# Vivado block design base_with_comblock_desing, xc7z020clg400-1, Vivado 2019.1
# (continued, part 2 of 3)
current_bd_instance /video/hdmi_out

create_bd_cell -type ip -vlnv xilinx.com:ip:axis_register_slice:1.1 axis_register_slice_0
create_bd_cell -type ip -vlnv xilinx.com:hls:color_convert:1.0 color_convert
create_bd_cell -type hier frontend
create_bd_cell -type ip -vlnv xilinx.com:hls:pixel_unpack:1.0 pixel_unpack

# ---- hierarchy /video/hdmi_out/frontend ----
current_bd_instance /video/hdmi_out/frontend
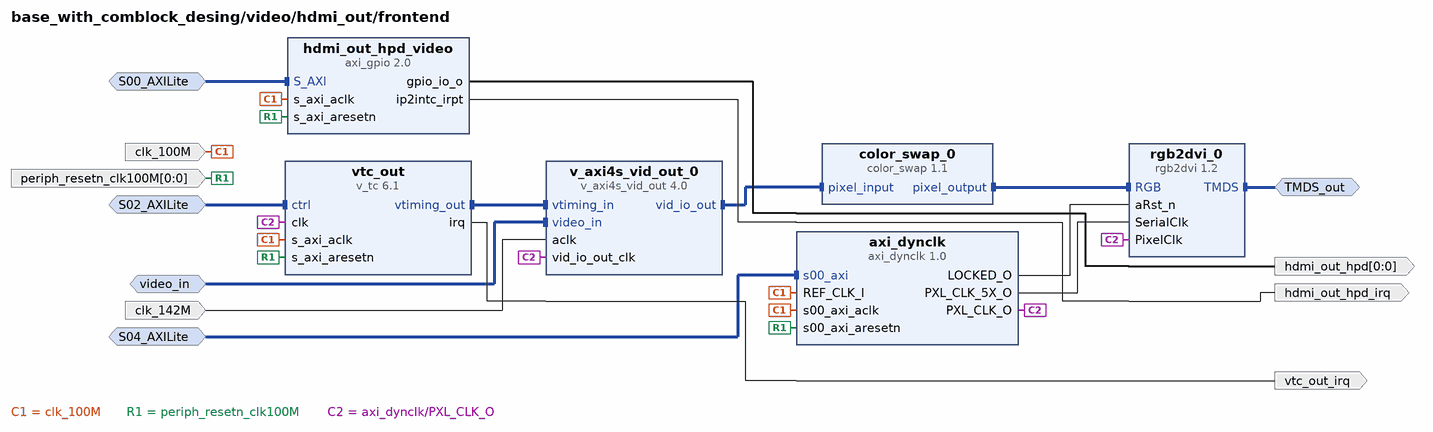
[diagram p17: block diagram inside /video/hdmi_out/frontend]
create_bd_intf_pin -mode Slave -vlnv xilinx.com:interface:aximm_rtl:1.0 S00_AXILite
create_bd_intf_pin -mode Slave -vlnv xilinx.com:interface:aximm_rtl:1.0 S02_AXILite
create_bd_intf_pin -mode Slave -vlnv xilinx.com:interface:aximm_rtl:1.0 S04_AXILite
create_bd_intf_pin -mode Master -vlnv digilentinc.com:interface:tmds_rtl:1.0 TMDS_out
create_bd_intf_pin -mode Slave -vlnv xilinx.com:interface:axis_rtl:1.0 video_in
create_bd_pin -dir I -type clk clk_100M
create_bd_pin -dir I -type clk clk_142M
create_bd_pin -dir O -from 0 -to 0 hdmi_out_hpd
create_bd_pin -dir O -type intr hdmi_out_hpd_irq
create_bd_pin -dir I -from 0 -to 0 -type rst periph_resetn_clk100M
create_bd_pin -dir O -type intr vtc_out_irq

create_bd_cell -type ip -vlnv digilentinc.com:ip:axi_dynclk:1.0 axi_dynclk
create_bd_cell -type ip -vlnv xilinx.com:user:color_swap:1.1 color_swap_0
create_bd_cell -type ip -vlnv xilinx.com:ip:axi_gpio:2.0 hdmi_out_hpd_video
set_property -dict {CONFIG.C_ALL_OUTPUTS 1 CONFIG.C_GPIO_WIDTH 1 CONFIG.C_INTERRUPT_PRESENT 1} [get_bd_cells hdmi_out_hpd_video]
create_bd_cell -type ip -vlnv digilentinc.com:ip:rgb2dvi:1.2 rgb2dvi_0
set_property -dict {CONFIG.kClkRange 2 CONFIG.kGenerateSerialClk false CONFIG.kRstActiveHigh false} [get_bd_cells rgb2dvi_0]
create_bd_cell -type ip -vlnv xilinx.com:ip:v_axi4s_vid_out:4.0 v_axi4s_vid_out_0
set_property -dict [list \
  CONFIG.C_ADDR_WIDTH 11 \
  CONFIG.C_HAS_ASYNC_CLK 1 \
  CONFIG.C_HYSTERESIS_LEVEL 1024 \
  CONFIG.C_VTG_MASTER_SLAVE 1 \
] [get_bd_cells v_axi4s_vid_out_0]
create_bd_cell -type ip -vlnv xilinx.com:ip:v_tc:6.1 vtc_out
set_property -dict {CONFIG.enable_detection false} [get_bd_cells vtc_out]

# ---- connections ----

current_bd_instance /iop_arduino
connect_bd_intf_net [get_bd_intf_pins lmb/BRAM_PORTB] [get_bd_intf_pins mb_bram_ctrl/BRAM_PORTA]
connect_bd_intf_net [get_bd_intf_pins ck_io] [get_bd_intf_pins gpio_subsystem/ck_gpio]
connect_bd_intf_net [get_bd_intf_pins S_AXI] [get_bd_intf_pins mb_bram_ctrl/S_AXI]
connect_bd_intf_net [get_bd_intf_pins arduino_gpio] [get_bd_intf_pins io_switch_0/io]
connect_bd_intf_net [get_bd_intf_pins Vaux0] [get_bd_intf_pins xadc/Vaux0]
connect_bd_intf_net [get_bd_intf_pins arduino_direct_iic] [get_bd_intf_pins iic_subsystem/arduino_direct_iic]
connect_bd_intf_net [get_bd_intf_pins Vaux13] [get_bd_intf_pins xadc/Vaux13]
connect_bd_intf_net [get_bd_intf_pins Vaux15] [get_bd_intf_pins xadc/Vaux15]
connect_bd_intf_net [get_bd_intf_pins Vaux1] [get_bd_intf_pins xadc/Vaux1]
connect_bd_intf_net [get_bd_intf_pins Vaux9] [get_bd_intf_pins xadc/Vaux9]
connect_bd_intf_net [get_bd_intf_pins Vaux12] [get_bd_intf_pins xadc/Vaux12]
connect_bd_intf_net [get_bd_intf_pins intc/interrupt] [get_bd_intf_pins mb/INTERRUPT]
connect_bd_intf_net [get_bd_intf_pins Vaux6] [get_bd_intf_pins xadc/Vaux6]
connect_bd_intf_net [get_bd_intf_pins arduino_direct_spi] [get_bd_intf_pins spi_subsystem/arduino_direct_spi]
connect_bd_intf_net [get_bd_intf_pins Vp_Vn] [get_bd_intf_pins xadc/Vp_Vn]
connect_bd_intf_net [get_bd_intf_pins Vaux5] [get_bd_intf_pins xadc/Vaux5]
connect_bd_intf_net [get_bd_intf_pins gpio_subsystem/arduino_gpio] [get_bd_intf_pins io_switch_0/gpio]
connect_bd_intf_net [get_bd_intf_pins Vaux8] [get_bd_intf_pins xadc/Vaux8]
connect_bd_intf_net [get_bd_intf_pins intr/S_AXI] [get_bd_intf_pins microblaze_0_axi_periph/M04_AXI]
connect_bd_intf_net [get_bd_intf_pins M_AXI] [get_bd_intf_pins microblaze_0_axi_periph/M07_AXI]
connect_bd_intf_net [get_bd_intf_pins io_switch_0/S_AXI] [get_bd_intf_pins microblaze_0_axi_periph/M02_AXI]
connect_bd_intf_net [get_bd_intf_pins gpio_subsystem/S01_AXILite] [get_bd_intf_pins microblaze_0_axi_periph/M03_AXI]
connect_bd_intf_net [get_bd_intf_pins iic_subsystem/S_AXI1] [get_bd_intf_pins microblaze_0_axi_periph/M01_AXI]
connect_bd_intf_net [get_bd_intf_pins gpio_subsystem/S00_AXILite] [get_bd_intf_pins microblaze_0_axi_periph/M05_AXI]
connect_bd_intf_net [get_bd_intf_pins microblaze_0_axi_periph/M00_AXI] [get_bd_intf_pins spi_subsystem/S00_AXILite]
connect_bd_intf_net [get_bd_intf_pins microblaze_0_axi_periph/M06_AXI] [get_bd_intf_pins spi_subsystem/S01_AXILite]
connect_bd_intf_net [get_bd_intf_pins mb/M_AXI_DP] [get_bd_intf_pins microblaze_0_axi_periph/S00_AXI]
connect_bd_intf_net [get_bd_intf_pins microblaze_0_axi_periph/M11_AXI] [get_bd_intf_pins timers_subsystem/S02_AXILite]
connect_bd_intf_net [get_bd_intf_pins microblaze_0_axi_periph/M16_AXI] [get_bd_intf_pins timers_subsystem/S05_AXILite]
connect_bd_intf_net [get_bd_intf_pins intc/s_axi] [get_bd_intf_pins microblaze_0_axi_periph/M14_AXI]
connect_bd_intf_net [get_bd_intf_pins microblaze_0_axi_periph/M15_AXI] [get_bd_intf_pins xadc/s_axi_lite]
connect_bd_intf_net [get_bd_intf_pins microblaze_0_axi_periph/M08_AXI] [get_bd_intf_pins uartlite/S_AXI]
connect_bd_intf_net [get_bd_intf_pins microblaze_0_axi_periph/M09_AXI] [get_bd_intf_pins timers_subsystem/S00_AXILite]
connect_bd_intf_net [get_bd_intf_pins microblaze_0_axi_periph/M12_AXI] [get_bd_intf_pins timers_subsystem/S03_AXILite]
connect_bd_intf_net [get_bd_intf_pins microblaze_0_axi_periph/M13_AXI] [get_bd_intf_pins timers_subsystem/S04_AXILite]
connect_bd_intf_net [get_bd_intf_pins DEBUG] [get_bd_intf_pins mb/DEBUG]
connect_bd_intf_net [get_bd_intf_pins microblaze_0_axi_periph/M10_AXI] [get_bd_intf_pins timers_subsystem/S01_AXILite]
connect_bd_intf_net [get_bd_intf_pins lmb/DLMB] [get_bd_intf_pins mb/DLMB]
connect_bd_intf_net [get_bd_intf_pins io_switch_0/uart0] [get_bd_intf_pins uartlite/UART]
connect_bd_intf_net [get_bd_intf_pins lmb/ILMB] [get_bd_intf_pins mb/ILMB]
connect_bd_intf_net [get_bd_intf_pins io_switch_0/spi0] [get_bd_intf_pins spi_subsystem/SPI_0]
connect_bd_net -net capture_i_1 [get_bd_pins io_switch_0/timer_i] [get_bd_pins timers_subsystem/capture_i]
connect_bd_net [get_bd_pins dff_en_reset_vector_0/q] [get_bd_pins intr_req]
connect_bd_net -net interrupts_concat_dout [get_bd_pins intr_concat/dout] [get_bd_pins intc/intr]
connect_bd_net [get_bd_pins logic_1/dout] [get_bd_pins dff_en_reset_vector_0/d] [get_bd_pins rst_clk_wiz_1_100M/ext_reset_in]
connect_bd_net -net mb3_gpio_subsystem_ip2intc_irpt [get_bd_pins gpio_subsystem/ip2intc_irpt] [get_bd_pins intr_concat/In5]
connect_bd_net -net mb3_iic_subsystem_iic2intc_irpt [get_bd_pins iic_subsystem/iic2intc_irpt] [get_bd_pins intr_concat/In1]
connect_bd_net -net mb3_intr_ack_1 [get_bd_pins intr_ack] [get_bd_pins dff_en_reset_vector_0/reset]
connect_bd_net -net mb3_intr_gpio_io_o [get_bd_pins intr/gpio_io_o] [get_bd_pins dff_en_reset_vector_0/en]
connect_bd_net -net mb3_spi_subsystem_ip2intc_irpt [get_bd_pins spi_subsystem/ip2intc_irpt] [get_bd_pins intr_concat/In2]
connect_bd_net -net mb3_spi_subsystem_ip2intc_irpt1 [get_bd_pins spi_subsystem/ip2intc_irpt1] [get_bd_pins intr_concat/In3]
connect_bd_net -net mb3_timers_subsystem_generate_o [get_bd_pins timers_subsystem/generate_o] [get_bd_pins io_switch_0/timer_o]
connect_bd_net -net mb3_timers_subsystem_mb3_timer_interrupts [get_bd_pins timers_subsystem/timer_interrupts] [get_bd_pins intr_concat/In0]
connect_bd_net -net mb3_timers_subsystem_pwm_o [get_bd_pins timers_subsystem/pwm_o] [get_bd_pins io_switch_0/pwm_o]
connect_bd_net -net mb3_uartlite_d1_d0_interrupt [get_bd_pins uartlite/interrupt] [get_bd_pins intr_concat/In4]
connect_bd_net -net mb_1_reset_Dout [get_bd_pins aux_reset_in] [get_bd_pins rst_clk_wiz_1_100M/aux_reset_in]
connect_bd_net -net mdm_1_debug_sys_rst [get_bd_pins mb_debug_sys_rst] [get_bd_pins rst_clk_wiz_1_100M/mb_debug_sys_rst]
connect_bd_net -net ps7_0_FCLK_CLK0 [get_bd_pins clk_100M] \
  [get_bd_pins dff_en_reset_vector_0/clk] [get_bd_pins gpio_subsystem/s_axi_aclk] [get_bd_pins iic_subsystem/s_axi_aclk] \
  [get_bd_pins intc/s_axi_aclk] [get_bd_pins intr/s_axi_aclk] [get_bd_pins io_switch_0/s_axi_aclk] [get_bd_pins lmb/LMB_Clk] \
  [get_bd_pins mb/Clk] [get_bd_pins mb_bram_ctrl/s_axi_aclk] [get_bd_pins microblaze_0_axi_periph/ACLK] \
  [get_bd_pins microblaze_0_axi_periph/M00_ACLK] [get_bd_pins microblaze_0_axi_periph/M01_ACLK] \
  [get_bd_pins microblaze_0_axi_periph/M02_ACLK] [get_bd_pins microblaze_0_axi_periph/M03_ACLK] \
  [get_bd_pins microblaze_0_axi_periph/M04_ACLK] [get_bd_pins microblaze_0_axi_periph/M05_ACLK] \
  [get_bd_pins microblaze_0_axi_periph/M06_ACLK] [get_bd_pins microblaze_0_axi_periph/M07_ACLK] \
  [get_bd_pins microblaze_0_axi_periph/M08_ACLK] [get_bd_pins microblaze_0_axi_periph/M09_ACLK] \
  [get_bd_pins microblaze_0_axi_periph/M10_ACLK] [get_bd_pins microblaze_0_axi_periph/M11_ACLK] \
  [get_bd_pins microblaze_0_axi_periph/M12_ACLK] [get_bd_pins microblaze_0_axi_periph/M13_ACLK] \
  [get_bd_pins microblaze_0_axi_periph/M14_ACLK] [get_bd_pins microblaze_0_axi_periph/M15_ACLK] \
  [get_bd_pins microblaze_0_axi_periph/M16_ACLK] [get_bd_pins microblaze_0_axi_periph/S00_ACLK] \
  [get_bd_pins rst_clk_wiz_1_100M/slowest_sync_clk] [get_bd_pins spi_subsystem/s_axi_aclk] \
  [get_bd_pins timers_subsystem/s_axi_aclk] [get_bd_pins uartlite/s_axi_aclk] [get_bd_pins xadc/s_axi_aclk]
connect_bd_net [get_bd_pins rst_clk_wiz_1_100M/bus_struct_reset] [get_bd_pins lmb/SYS_Rst]
connect_bd_net [get_bd_pins rst_clk_wiz_1_100M/interconnect_aresetn] [get_bd_pins microblaze_0_axi_periph/ARESETN]
connect_bd_net [get_bd_pins rst_clk_wiz_1_100M/mb_reset] [get_bd_pins mb/Reset]
connect_bd_net [get_bd_pins rst_clk_wiz_1_100M/peripheral_aresetn] \
  [get_bd_pins peripheral_aresetn] [get_bd_pins gpio_subsystem/s_axi_aresetn] [get_bd_pins iic_subsystem/s_axi_aresetn1] \
  [get_bd_pins intc/s_axi_aresetn] [get_bd_pins io_switch_0/s_axi_aresetn] [get_bd_pins microblaze_0_axi_periph/M00_ARESETN] \
  [get_bd_pins microblaze_0_axi_periph/M01_ARESETN] [get_bd_pins microblaze_0_axi_periph/M02_ARESETN] \
  [get_bd_pins microblaze_0_axi_periph/M03_ARESETN] [get_bd_pins microblaze_0_axi_periph/M04_ARESETN] \
  [get_bd_pins microblaze_0_axi_periph/M05_ARESETN] [get_bd_pins microblaze_0_axi_periph/M06_ARESETN] \
  [get_bd_pins microblaze_0_axi_periph/M07_ARESETN] [get_bd_pins microblaze_0_axi_periph/M10_ARESETN] \
  [get_bd_pins microblaze_0_axi_periph/M11_ARESETN] [get_bd_pins microblaze_0_axi_periph/M12_ARESETN] \
  [get_bd_pins microblaze_0_axi_periph/M13_ARESETN] [get_bd_pins microblaze_0_axi_periph/M15_ARESETN] \
  [get_bd_pins microblaze_0_axi_periph/S00_ARESETN] [get_bd_pins spi_subsystem/s_axi_aresetn] \
  [get_bd_pins timers_subsystem/s_axi_aresetn]
connect_bd_net [get_bd_pins s_axi_aresetn] \
  [get_bd_pins intr/s_axi_aresetn] [get_bd_pins mb_bram_ctrl/s_axi_aresetn] [get_bd_pins microblaze_0_axi_periph/M08_ARESETN] \
  [get_bd_pins microblaze_0_axi_periph/M09_ARESETN] [get_bd_pins microblaze_0_axi_periph/M14_ARESETN] \
  [get_bd_pins microblaze_0_axi_periph/M16_ARESETN] [get_bd_pins spi_subsystem/s_axi_aresetn1] \
  [get_bd_pins uartlite/s_axi_aresetn] [get_bd_pins xadc/s_axi_aresetn]
set_property HDL_ATTRIBUTE.BMM_INFO_PROCESSOR {microblaze-le > base_with_comblock_desing iop_arduino/lmb/lmb_bram_if_cntlr} [get_bd_cells mb]
set_property HDL_ATTRIBUTE.KEEP_HIERARCHY yes [get_bd_cells mb]
set_property HDL_ATTRIBUTE.BMM_INFO_ADDRESS_SPACE {byte  0x44000000 32 > base_with_comblock_desing iop_arduino/lmb/lmb_bram} [get_bd_cells mb_bram_ctrl]
set_property HDL_ATTRIBUTE.KEEP_HIERARCHY yes [get_bd_cells mb_bram_ctrl]

current_bd_instance /iop_arduino/gpio_subsystem
connect_bd_intf_net [get_bd_intf_pins ck_gpio] [get_bd_intf_pins ck_gpio/GPIO]
connect_bd_intf_net [get_bd_intf_pins S01_AXILite] [get_bd_intf_pins ck_gpio/S_AXI]
connect_bd_intf_net [get_bd_intf_pins arduino_gpio] [get_bd_intf_pins arduino_gpio/GPIO]
connect_bd_intf_net [get_bd_intf_pins S00_AXILite] [get_bd_intf_pins arduino_gpio/S_AXI]
connect_bd_net -net mb3_arduino_gpio_d13_d0_a5_a0_ip2intc_irpt [get_bd_pins arduino_gpio/ip2intc_irpt] [get_bd_pins ip2intc_irpt]
connect_bd_net -net ps7_0_FCLK_CLK0 [get_bd_pins s_axi_aclk] [get_bd_pins arduino_gpio/s_axi_aclk] [get_bd_pins ck_gpio/s_axi_aclk]
connect_bd_net -net rst_clk_wiz_1_100M_peripheral_aresetn [get_bd_pins s_axi_aresetn] \
  [get_bd_pins arduino_gpio/s_axi_aresetn] [get_bd_pins ck_gpio/s_axi_aresetn]

current_bd_instance /iop_arduino/iic_subsystem
connect_bd_intf_net [get_bd_intf_pins S_AXI1] [get_bd_intf_pins iic_direct/S_AXI]
connect_bd_intf_net [get_bd_intf_pins arduino_direct_iic] [get_bd_intf_pins iic_direct/IIC]
connect_bd_net -net mb3_iic_iic2intc_irpt [get_bd_pins iic_direct/iic2intc_irpt] [get_bd_pins iic2intc_irpt]
connect_bd_net -net ps7_0_FCLK_CLK0 [get_bd_pins s_axi_aclk] [get_bd_pins iic_direct/s_axi_aclk]
connect_bd_net -net rst_clk_wiz_1_100M_peripheral_aresetn [get_bd_pins s_axi_aresetn1] [get_bd_pins iic_direct/s_axi_aresetn]

current_bd_instance /iop_arduino/lmb
connect_bd_intf_net [get_bd_intf_pins dlmb_v10/LMB_Sl_0] [get_bd_intf_pins lmb_bram_if_cntlr/SLMB1]
connect_bd_intf_net [get_bd_intf_pins BRAM_PORTB] [get_bd_intf_pins lmb_bram/BRAM_PORTB]
connect_bd_intf_net [get_bd_intf_pins lmb_bram/BRAM_PORTA] [get_bd_intf_pins lmb_bram_if_cntlr/BRAM_PORT]
connect_bd_intf_net [get_bd_intf_pins DLMB] [get_bd_intf_pins dlmb_v10/LMB_M]
connect_bd_intf_net [get_bd_intf_pins ilmb_v10/LMB_Sl_0] [get_bd_intf_pins lmb_bram_if_cntlr/SLMB]
connect_bd_intf_net [get_bd_intf_pins ILMB] [get_bd_intf_pins ilmb_v10/LMB_M]
connect_bd_net [get_bd_pins SYS_Rst] [get_bd_pins dlmb_v10/SYS_Rst] [get_bd_pins ilmb_v10/SYS_Rst] [get_bd_pins lmb_bram_if_cntlr/LMB_Rst]
connect_bd_net -net microblaze_0_Clk [get_bd_pins LMB_Clk] \
  [get_bd_pins dlmb_v10/LMB_Clk] [get_bd_pins ilmb_v10/LMB_Clk] [get_bd_pins lmb_bram_if_cntlr/LMB_Clk]
set_property HDL_ATTRIBUTE.BMM_INFO_ADDRESS_SPACE {byte  0x00000000 32 > base_with_comblock_desing iop_arduino/lmb/lmb_bram} [get_bd_cells lmb_bram_if_cntlr]
set_property HDL_ATTRIBUTE.KEEP_HIERARCHY yes [get_bd_cells lmb_bram_if_cntlr]

current_bd_instance /iop_arduino/spi_subsystem
connect_bd_intf_net [get_bd_intf_pins arduino_direct_spi] [get_bd_intf_pins spi_direct/SPI_0]
connect_bd_intf_net [get_bd_intf_pins SPI_0] [get_bd_intf_pins spi_shared/SPI_0]
connect_bd_intf_net [get_bd_intf_pins S01_AXILite] [get_bd_intf_pins spi_shared/AXI_LITE]
connect_bd_intf_net [get_bd_intf_pins S00_AXILite] [get_bd_intf_pins spi_direct/AXI_LITE]
connect_bd_net -net mb3_spi_pl_sw_d13_d10_ip2intc_irpt [get_bd_pins spi_shared/ip2intc_irpt] [get_bd_pins ip2intc_irpt1]
connect_bd_net -net mb3_spi_pl_sw_ip2intc_irpt [get_bd_pins spi_direct/ip2intc_irpt] [get_bd_pins ip2intc_irpt]
connect_bd_net -net ps7_0_FCLK_CLK0 [get_bd_pins s_axi_aclk] \
  [get_bd_pins spi_direct/ext_spi_clk] [get_bd_pins spi_direct/s_axi_aclk] [get_bd_pins spi_shared/ext_spi_clk] \
  [get_bd_pins spi_shared/s_axi_aclk]
connect_bd_net -net rst_clk_wiz_1_100M_peripheral_aresetn [get_bd_pins s_axi_aresetn] [get_bd_pins spi_direct/s_axi_aresetn]
connect_bd_net [get_bd_pins s_axi_aresetn1] [get_bd_pins spi_shared/s_axi_aresetn]

current_bd_instance /iop_arduino/timers_subsystem
connect_bd_intf_net [get_bd_intf_pins S00_AXILite] [get_bd_intf_pins timer_0/S_AXI]
connect_bd_intf_net [get_bd_intf_pins S05_AXILite] [get_bd_intf_pins timer_5/S_AXI]
connect_bd_intf_net [get_bd_intf_pins S02_AXILite] [get_bd_intf_pins timer_2/S_AXI]
connect_bd_intf_net [get_bd_intf_pins S01_AXILite] [get_bd_intf_pins timer_1/S_AXI]
connect_bd_intf_net [get_bd_intf_pins S03_AXILite] [get_bd_intf_pins timer_3/S_AXI]
connect_bd_intf_net [get_bd_intf_pins S04_AXILite] [get_bd_intf_pins timer_4/S_AXI]
connect_bd_net -net arduino_io_switch_0_timer_i_in [get_bd_pins capture_i] \
  [get_bd_pins mb3_timer_capture_0/Din] [get_bd_pins mb3_timer_capture_1/Din] [get_bd_pins mb3_timer_capture_2/Din] \
  [get_bd_pins mb3_timer_capture_3/Din] [get_bd_pins mb3_timer_capture_4/Din] [get_bd_pins mb3_timer_capture_5/Din] \
  [get_bd_pins mb3_timer_capture_6/Din] [get_bd_pins mb3_timer_capture_7/Din]
connect_bd_net -net mb3_timer_0_generateout0 [get_bd_pins timer_0/generateout0] [get_bd_pins mb3_timer_generate/In0]
connect_bd_net -net mb3_timer_0_interrupt [get_bd_pins timer_0/interrupt] [get_bd_pins mb3_timers_interrupt/In0]
connect_bd_net -net mb3_timer_0_pwm0 [get_bd_pins timer_0/pwm0] [get_bd_pins mb3_timer_pwm/In0]
connect_bd_net -net mb3_timer_1_generateout0 [get_bd_pins timer_1/generateout0] [get_bd_pins mb3_timer_generate/In1]
connect_bd_net -net mb3_timer_1_interrupt [get_bd_pins timer_1/interrupt] [get_bd_pins mb3_timers_interrupt/In1]
connect_bd_net -net mb3_timer_1_pwm0 [get_bd_pins timer_1/pwm0] [get_bd_pins mb3_timer_pwm/In1]
connect_bd_net -net mb3_timer_2_generateout0 [get_bd_pins timer_2/generateout0] [get_bd_pins mb3_timer_generate/In2]
connect_bd_net -net mb3_timer_2_interrupt [get_bd_pins timer_2/interrupt] [get_bd_pins mb3_timers_interrupt/In2]
connect_bd_net -net mb3_timer_2_pwm0 [get_bd_pins timer_2/pwm0] [get_bd_pins mb3_timer_pwm/In2]
connect_bd_net -net mb3_timer_3_generateout0 [get_bd_pins timer_3/generateout0] [get_bd_pins mb3_timer_generate/In3]
connect_bd_net -net mb3_timer_3_interrupt [get_bd_pins timer_3/interrupt] [get_bd_pins mb3_timers_interrupt/In3]
connect_bd_net -net mb3_timer_3_pwm0 [get_bd_pins timer_3/pwm0] [get_bd_pins mb3_timer_pwm/In3]
connect_bd_net -net mb3_timer_4_generateout0 [get_bd_pins timer_4/generateout0] [get_bd_pins mb3_timer_generate/In4]
connect_bd_net -net mb3_timer_4_interrupt [get_bd_pins timer_4/interrupt] [get_bd_pins mb3_timers_interrupt/In4]
connect_bd_net -net mb3_timer_4_pwm0 [get_bd_pins timer_4/pwm0] [get_bd_pins mb3_timer_pwm/In4]
connect_bd_net -net mb3_timer_5_generateout0 [get_bd_pins timer_5/generateout0] [get_bd_pins mb3_timer_generate/In5]
connect_bd_net -net mb3_timer_5_interrupt [get_bd_pins timer_5/interrupt] [get_bd_pins mb3_timers_interrupt/In5]
connect_bd_net -net mb3_timer_5_pwm0 [get_bd_pins timer_5/pwm0] [get_bd_pins mb3_timer_pwm/In5]
connect_bd_net [get_bd_pins mb3_timer_capture_0/Dout] [get_bd_pins timer_0/capturetrig0]
connect_bd_net [get_bd_pins mb3_timer_capture_1/Dout] [get_bd_pins timer_1/capturetrig0]
connect_bd_net [get_bd_pins mb3_timer_capture_2/Dout] [get_bd_pins timer_2/capturetrig0]
connect_bd_net [get_bd_pins mb3_timer_capture_3/Dout] [get_bd_pins timer_3/capturetrig0]
connect_bd_net [get_bd_pins mb3_timer_capture_4/Dout] [get_bd_pins timer_4/capturetrig0]
connect_bd_net [get_bd_pins mb3_timer_capture_5/Dout] [get_bd_pins timer_5/capturetrig0]
connect_bd_net [get_bd_pins mb3_timer_capture_6/Dout] [get_bd_pins timer_1/capturetrig1]
connect_bd_net [get_bd_pins mb3_timer_capture_7/Dout] [get_bd_pins timer_2/capturetrig1]
connect_bd_net [get_bd_pins mb3_timer_generate/dout] [get_bd_pins generate_o]
connect_bd_net [get_bd_pins mb3_timer_pwm/dout] [get_bd_pins pwm_o]
connect_bd_net [get_bd_pins mb3_timers_interrupt/dout] [get_bd_pins timer_interrupts]
connect_bd_net -net ps7_0_FCLK_CLK0 [get_bd_pins s_axi_aclk] \
  [get_bd_pins timer_0/s_axi_aclk] [get_bd_pins timer_1/s_axi_aclk] [get_bd_pins timer_2/s_axi_aclk] \
  [get_bd_pins timer_3/s_axi_aclk] [get_bd_pins timer_4/s_axi_aclk] [get_bd_pins timer_5/s_axi_aclk]
connect_bd_net -net rst_clk_wiz_1_100M_peripheral_aresetn [get_bd_pins s_axi_aresetn] \
  [get_bd_pins timer_0/s_axi_aresetn] [get_bd_pins timer_1/s_axi_aresetn] [get_bd_pins timer_2/s_axi_aresetn] \
  [get_bd_pins timer_3/s_axi_aresetn] [get_bd_pins timer_4/s_axi_aresetn] [get_bd_pins timer_5/s_axi_aresetn]
connect_bd_net [get_bd_pins timer_1/generateout1] [get_bd_pins mb3_timer_generate/In6]
connect_bd_net [get_bd_pins timer_2/generateout1] [get_bd_pins mb3_timer_generate/In7]

current_bd_instance /iop_pmoda
connect_bd_intf_net [get_bd_intf_pins lmb/BRAM_PORTB] [get_bd_intf_pins mb_bram_ctrl/BRAM_PORTA]
connect_bd_intf_net [get_bd_intf_pins M_AXI] [get_bd_intf_pins microblaze_0_axi_periph/M07_AXI]
connect_bd_intf_net [get_bd_intf_pins S_AXI] [get_bd_intf_pins mb_bram_ctrl/S_AXI]
connect_bd_intf_net [get_bd_intf_pins pmoda_gpio] [get_bd_intf_pins io_switch/io]
connect_bd_intf_net [get_bd_intf_pins DEBUG] [get_bd_intf_pins mb/DEBUG]
connect_bd_intf_net [get_bd_intf_pins lmb/DLMB] [get_bd_intf_pins mb/DLMB]
connect_bd_intf_net [get_bd_intf_pins iic/S_AXI] [get_bd_intf_pins microblaze_0_axi_periph/M01_AXI]
connect_bd_intf_net [get_bd_intf_pins io_switch/spi0] [get_bd_intf_pins spi/SPI_0]
connect_bd_intf_net [get_bd_intf_pins mb/M_AXI_DP] [get_bd_intf_pins microblaze_0_axi_periph/S00_AXI]
connect_bd_intf_net [get_bd_intf_pins microblaze_0_axi_periph/M04_AXI] [get_bd_intf_pins timer/S_AXI]
connect_bd_intf_net [get_bd_intf_pins lmb/ILMB] [get_bd_intf_pins mb/ILMB]
connect_bd_intf_net [get_bd_intf_pins intc/interrupt] [get_bd_intf_pins mb/INTERRUPT]
connect_bd_intf_net [get_bd_intf_pins intr/S_AXI] [get_bd_intf_pins microblaze_0_axi_periph/M06_AXI]
connect_bd_intf_net [get_bd_intf_pins gpio/S_AXI] [get_bd_intf_pins microblaze_0_axi_periph/M03_AXI]
connect_bd_intf_net [get_bd_intf_pins intc/s_axi] [get_bd_intf_pins microblaze_0_axi_periph/M05_AXI]
connect_bd_intf_net [get_bd_intf_pins iic/IIC] [get_bd_intf_pins io_switch/iic0]
connect_bd_intf_net [get_bd_intf_pins io_switch/S_AXI] [get_bd_intf_pins microblaze_0_axi_periph/M02_AXI]
connect_bd_intf_net [get_bd_intf_pins gpio/GPIO] [get_bd_intf_pins io_switch/gpio]
connect_bd_intf_net [get_bd_intf_pins microblaze_0_axi_periph/M00_AXI] [get_bd_intf_pins spi/AXI_LITE]
connect_bd_net [get_bd_pins dff_en_reset_vector_0/q] [get_bd_pins intr_req]
connect_bd_net -net io_switch_0_timer_i [get_bd_pins io_switch/timer_i] [get_bd_pins timer/capturetrig0]
connect_bd_net -net iop_pmoda_intr_ack_1 [get_bd_pins intr_ack] [get_bd_pins dff_en_reset_vector_0/reset]
connect_bd_net -net iop_pmoda_intr_gpio_io_o [get_bd_pins intr/gpio_io_o] [get_bd_pins dff_en_reset_vector_0/en]
connect_bd_net [get_bd_pins logic_1/dout] [get_bd_pins dff_en_reset_vector_0/d] [get_bd_pins rst_clk_wiz_1_100M/ext_reset_in]
connect_bd_net -net mb1_iic_iic2intc_irpt [get_bd_pins iic/iic2intc_irpt] [get_bd_pins intr_concat/In0]
connect_bd_net -net mb1_interrupt_concat_dout [get_bd_pins intr_concat/dout] [get_bd_pins intc/intr]
connect_bd_net -net mb1_spi_ip2intc_irpt [get_bd_pins spi/ip2intc_irpt] [get_bd_pins intr_concat/In1]
connect_bd_net -net mb1_timer_generateout0 [get_bd_pins timer/generateout0] [get_bd_pins io_switch/timer_o]
connect_bd_net -net mb1_timer_interrupt [get_bd_pins timer/interrupt] [get_bd_pins intr_concat/In2]
connect_bd_net -net mb1_timer_pwm0 [get_bd_pins timer/pwm0] [get_bd_pins io_switch/pwm_o]
connect_bd_net -net mb_1_reset_Dout [get_bd_pins aux_reset_in] [get_bd_pins rst_clk_wiz_1_100M/aux_reset_in]
connect_bd_net -net mdm_1_debug_sys_rst [get_bd_pins mb_debug_sys_rst] [get_bd_pins rst_clk_wiz_1_100M/mb_debug_sys_rst]
connect_bd_net -net ps7_0_FCLK_CLK0 [get_bd_pins clk_100M] \
  [get_bd_pins dff_en_reset_vector_0/clk] [get_bd_pins gpio/s_axi_aclk] [get_bd_pins iic/s_axi_aclk] \
  [get_bd_pins intc/s_axi_aclk] [get_bd_pins intr/s_axi_aclk] [get_bd_pins io_switch/s_axi_aclk] [get_bd_pins lmb/LMB_Clk] \
  [get_bd_pins mb/Clk] [get_bd_pins mb_bram_ctrl/s_axi_aclk] [get_bd_pins microblaze_0_axi_periph/ACLK] \
  [get_bd_pins microblaze_0_axi_periph/M00_ACLK] [get_bd_pins microblaze_0_axi_periph/M01_ACLK] \
  [get_bd_pins microblaze_0_axi_periph/M02_ACLK] [get_bd_pins microblaze_0_axi_periph/M03_ACLK] \
  [get_bd_pins microblaze_0_axi_periph/M04_ACLK] [get_bd_pins microblaze_0_axi_periph/M05_ACLK] \
  [get_bd_pins microblaze_0_axi_periph/M06_ACLK] [get_bd_pins microblaze_0_axi_periph/M07_ACLK] \
  [get_bd_pins microblaze_0_axi_periph/S00_ACLK] [get_bd_pins rst_clk_wiz_1_100M/slowest_sync_clk] \
  [get_bd_pins spi/ext_spi_clk] [get_bd_pins spi/s_axi_aclk] [get_bd_pins timer/s_axi_aclk]
connect_bd_net [get_bd_pins rst_clk_wiz_1_100M/bus_struct_reset] [get_bd_pins lmb/SYS_Rst]
connect_bd_net [get_bd_pins rst_clk_wiz_1_100M/interconnect_aresetn] [get_bd_pins microblaze_0_axi_periph/ARESETN]
connect_bd_net [get_bd_pins rst_clk_wiz_1_100M/mb_reset] [get_bd_pins mb/Reset]
connect_bd_net [get_bd_pins rst_clk_wiz_1_100M/peripheral_aresetn] \
  [get_bd_pins peripheral_aresetn] [get_bd_pins gpio/s_axi_aresetn] [get_bd_pins iic/s_axi_aresetn] \
  [get_bd_pins intc/s_axi_aresetn] [get_bd_pins microblaze_0_axi_periph/M00_ARESETN] \
  [get_bd_pins microblaze_0_axi_periph/M01_ARESETN] [get_bd_pins microblaze_0_axi_periph/M02_ARESETN] \
  [get_bd_pins microblaze_0_axi_periph/M03_ARESETN] [get_bd_pins microblaze_0_axi_periph/M04_ARESETN] \
  [get_bd_pins microblaze_0_axi_periph/M05_ARESETN] [get_bd_pins microblaze_0_axi_periph/M06_ARESETN] \
  [get_bd_pins microblaze_0_axi_periph/M07_ARESETN] [get_bd_pins microblaze_0_axi_periph/S00_ARESETN] \
  [get_bd_pins spi/s_axi_aresetn] [get_bd_pins timer/s_axi_aresetn]
connect_bd_net [get_bd_pins s_axi_aresetn] \
  [get_bd_pins intr/s_axi_aresetn] [get_bd_pins io_switch/s_axi_aresetn] [get_bd_pins mb_bram_ctrl/s_axi_aresetn]
set_property HDL_ATTRIBUTE.BMM_INFO_PROCESSOR {microblaze-le > base_with_comblock_desing iop_pmoda/lmb/lmb_bram_if_cntlr} [get_bd_cells mb]
set_property HDL_ATTRIBUTE.KEEP_HIERARCHY yes [get_bd_cells mb]
set_property HDL_ATTRIBUTE.BMM_INFO_ADDRESS_SPACE {byte  0x40000000 32 > base_with_comblock_desing iop_pmoda/lmb/lmb_bram} [get_bd_cells mb_bram_ctrl]
set_property HDL_ATTRIBUTE.KEEP_HIERARCHY yes [get_bd_cells mb_bram_ctrl]

current_bd_instance /iop_pmoda/lmb
connect_bd_intf_net [get_bd_intf_pins dlmb_v10/LMB_Sl_0] [get_bd_intf_pins lmb_bram_if_cntlr/SLMB1]
connect_bd_intf_net [get_bd_intf_pins BRAM_PORTB] [get_bd_intf_pins lmb_bram/BRAM_PORTB]
connect_bd_intf_net [get_bd_intf_pins lmb_bram/BRAM_PORTA] [get_bd_intf_pins lmb_bram_if_cntlr/BRAM_PORT]
connect_bd_intf_net [get_bd_intf_pins DLMB] [get_bd_intf_pins dlmb_v10/LMB_M]
connect_bd_intf_net [get_bd_intf_pins ILMB] [get_bd_intf_pins ilmb_v10/LMB_M]
connect_bd_intf_net [get_bd_intf_pins ilmb_v10/LMB_Sl_0] [get_bd_intf_pins lmb_bram_if_cntlr/SLMB]
connect_bd_net [get_bd_pins SYS_Rst] [get_bd_pins dlmb_v10/SYS_Rst] [get_bd_pins ilmb_v10/SYS_Rst] [get_bd_pins lmb_bram_if_cntlr/LMB_Rst]
connect_bd_net -net microblaze_0_Clk [get_bd_pins LMB_Clk] \
  [get_bd_pins dlmb_v10/LMB_Clk] [get_bd_pins ilmb_v10/LMB_Clk] [get_bd_pins lmb_bram_if_cntlr/LMB_Clk]
set_property HDL_ATTRIBUTE.BMM_INFO_ADDRESS_SPACE {byte  0x00000000 32 > base_with_comblock_desing iop_pmoda/lmb/lmb_bram} [get_bd_cells lmb_bram_if_cntlr]
set_property HDL_ATTRIBUTE.KEEP_HIERARCHY yes [get_bd_cells lmb_bram_if_cntlr]

current_bd_instance /iop_pmodb
connect_bd_intf_net [get_bd_intf_pins gpio/S_AXI] [get_bd_intf_pins microblaze_0_axi_periph/M03_AXI]
connect_bd_intf_net [get_bd_intf_pins pmodb_gpio] [get_bd_intf_pins io_switch/io]
connect_bd_intf_net [get_bd_intf_pins lmb/BRAM_PORTB] [get_bd_intf_pins mb_bram_ctrl/BRAM_PORTA]
connect_bd_intf_net [get_bd_intf_pins M_AXI] [get_bd_intf_pins microblaze_0_axi_periph/M07_AXI]
connect_bd_intf_net [get_bd_intf_pins S_AXI] [get_bd_intf_pins mb_bram_ctrl/S_AXI]
connect_bd_intf_net [get_bd_intf_pins lmb/DLMB] [get_bd_intf_pins mb/DLMB]
connect_bd_intf_net [get_bd_intf_pins lmb/ILMB] [get_bd_intf_pins mb/ILMB]
connect_bd_intf_net [get_bd_intf_pins io_switch/spi0] [get_bd_intf_pins spi/SPI_0]
connect_bd_intf_net [get_bd_intf_pins DEBUG] [get_bd_intf_pins mb/DEBUG]
connect_bd_intf_net [get_bd_intf_pins iic/IIC] [get_bd_intf_pins io_switch/iic0]
connect_bd_intf_net [get_bd_intf_pins intc/interrupt] [get_bd_intf_pins mb/INTERRUPT]
connect_bd_intf_net [get_bd_intf_pins gpio/GPIO] [get_bd_intf_pins io_switch/gpio]
connect_bd_intf_net [get_bd_intf_pins mb/M_AXI_DP] [get_bd_intf_pins microblaze_0_axi_periph/S00_AXI]
connect_bd_intf_net [get_bd_intf_pins intr/S_AXI] [get_bd_intf_pins microblaze_0_axi_periph/M06_AXI]
connect_bd_intf_net [get_bd_intf_pins microblaze_0_axi_periph/M00_AXI] [get_bd_intf_pins spi/AXI_LITE]
connect_bd_intf_net [get_bd_intf_pins io_switch/S_AXI] [get_bd_intf_pins microblaze_0_axi_periph/M02_AXI]
connect_bd_intf_net [get_bd_intf_pins iic/S_AXI] [get_bd_intf_pins microblaze_0_axi_periph/M01_AXI]
connect_bd_intf_net [get_bd_intf_pins intc/s_axi] [get_bd_intf_pins microblaze_0_axi_periph/M05_AXI]
connect_bd_intf_net [get_bd_intf_pins microblaze_0_axi_periph/M04_AXI] [get_bd_intf_pins timer/S_AXI]
connect_bd_net [get_bd_pins dff_en_reset_vector_0/q] [get_bd_pins intr_req]
connect_bd_net -net io_switch_0_timer_i [get_bd_pins io_switch/timer_i] [get_bd_pins timer/capturetrig0]
connect_bd_net -net iop_pmodb_intr_ack_1 [get_bd_pins intr_ack] [get_bd_pins dff_en_reset_vector_0/reset]
connect_bd_net -net iop_pmodb_intr_gpio_io_o [get_bd_pins intr/gpio_io_o] [get_bd_pins dff_en_reset_vector_0/en]
connect_bd_net [get_bd_pins logic_1/dout] [get_bd_pins dff_en_reset_vector_0/d] [get_bd_pins rst_clk_wiz_1_100M/ext_reset_in]
connect_bd_net -net mb2_concat_dout [get_bd_pins intr_concat/dout] [get_bd_pins intc/intr]
connect_bd_net -net mb2_iic_iic2intc_irpt [get_bd_pins iic/iic2intc_irpt] [get_bd_pins intr_concat/In0]
connect_bd_net -net mb2_spi_ip2intc_irpt [get_bd_pins spi/ip2intc_irpt] [get_bd_pins intr_concat/In1]
connect_bd_net -net mb2_timer_generateout0 [get_bd_pins timer/generateout0] [get_bd_pins io_switch/timer_o]
connect_bd_net -net mb2_timer_interrupt [get_bd_pins timer/interrupt] [get_bd_pins intr_concat/In2]
connect_bd_net -net mb2_timer_pwm0 [get_bd_pins timer/pwm0] [get_bd_pins io_switch/pwm_o]
connect_bd_net -net mb_1_reset_Dout [get_bd_pins aux_reset_in] [get_bd_pins rst_clk_wiz_1_100M/aux_reset_in]
connect_bd_net -net mdm_1_debug_sys_rst [get_bd_pins mb_debug_sys_rst] [get_bd_pins rst_clk_wiz_1_100M/mb_debug_sys_rst]
connect_bd_net -net ps7_0_FCLK_CLK0 [get_bd_pins clk_100M] \
  [get_bd_pins dff_en_reset_vector_0/clk] [get_bd_pins gpio/s_axi_aclk] [get_bd_pins iic/s_axi_aclk] \
  [get_bd_pins intc/s_axi_aclk] [get_bd_pins intr/s_axi_aclk] [get_bd_pins io_switch/s_axi_aclk] [get_bd_pins lmb/LMB_Clk] \
  [get_bd_pins mb/Clk] [get_bd_pins mb_bram_ctrl/s_axi_aclk] [get_bd_pins microblaze_0_axi_periph/ACLK] \
  [get_bd_pins microblaze_0_axi_periph/M00_ACLK] [get_bd_pins microblaze_0_axi_periph/M01_ACLK] \
  [get_bd_pins microblaze_0_axi_periph/M02_ACLK] [get_bd_pins microblaze_0_axi_periph/M03_ACLK] \
  [get_bd_pins microblaze_0_axi_periph/M04_ACLK] [get_bd_pins microblaze_0_axi_periph/M05_ACLK] \
  [get_bd_pins microblaze_0_axi_periph/M06_ACLK] [get_bd_pins microblaze_0_axi_periph/M07_ACLK] \
  [get_bd_pins microblaze_0_axi_periph/S00_ACLK] [get_bd_pins rst_clk_wiz_1_100M/slowest_sync_clk] \
  [get_bd_pins spi/ext_spi_clk] [get_bd_pins spi/s_axi_aclk] [get_bd_pins timer/s_axi_aclk]
connect_bd_net [get_bd_pins rst_clk_wiz_1_100M/bus_struct_reset] [get_bd_pins lmb/SYS_Rst]
connect_bd_net [get_bd_pins rst_clk_wiz_1_100M/interconnect_aresetn] [get_bd_pins microblaze_0_axi_periph/ARESETN]
connect_bd_net [get_bd_pins rst_clk_wiz_1_100M/mb_reset] [get_bd_pins mb/Reset]
connect_bd_net [get_bd_pins rst_clk_wiz_1_100M/peripheral_aresetn] \
  [get_bd_pins peripheral_aresetn] [get_bd_pins gpio/s_axi_aresetn] [get_bd_pins iic/s_axi_aresetn] \
  [get_bd_pins intc/s_axi_aresetn] [get_bd_pins microblaze_0_axi_periph/M00_ARESETN] \
  [get_bd_pins microblaze_0_axi_periph/M01_ARESETN] [get_bd_pins microblaze_0_axi_periph/M02_ARESETN] \
  [get_bd_pins microblaze_0_axi_periph/M03_ARESETN] [get_bd_pins microblaze_0_axi_periph/M04_ARESETN] \
  [get_bd_pins microblaze_0_axi_periph/M05_ARESETN] [get_bd_pins microblaze_0_axi_periph/M06_ARESETN] \
  [get_bd_pins microblaze_0_axi_periph/M07_ARESETN] [get_bd_pins microblaze_0_axi_periph/S00_ARESETN] \
  [get_bd_pins spi/s_axi_aresetn] [get_bd_pins timer/s_axi_aresetn]
connect_bd_net [get_bd_pins s_axi_aresetn] \
  [get_bd_pins intr/s_axi_aresetn] [get_bd_pins io_switch/s_axi_aresetn] [get_bd_pins mb_bram_ctrl/s_axi_aresetn]
set_property HDL_ATTRIBUTE.BMM_INFO_PROCESSOR {microblaze-le > base_with_comblock_desing iop_pmodb/lmb/lmb_bram_if_cntlr} [get_bd_cells mb]
set_property HDL_ATTRIBUTE.KEEP_HIERARCHY yes [get_bd_cells mb]
set_property HDL_ATTRIBUTE.BMM_INFO_ADDRESS_SPACE {byte  0x42000000 32 > base_with_comblock_desing iop_pmodb/lmb/lmb_bram} [get_bd_cells mb_bram_ctrl]
set_property HDL_ATTRIBUTE.KEEP_HIERARCHY yes [get_bd_cells mb_bram_ctrl]

current_bd_instance /iop_pmodb/lmb
connect_bd_intf_net [get_bd_intf_pins dlmb_v10/LMB_Sl_0] [get_bd_intf_pins lmb_bram_if_cntlr/SLMB1]
connect_bd_intf_net [get_bd_intf_pins BRAM_PORTB] [get_bd_intf_pins lmb_bram/BRAM_PORTB]
connect_bd_intf_net [get_bd_intf_pins ILMB] [get_bd_intf_pins ilmb_v10/LMB_M]
connect_bd_intf_net [get_bd_intf_pins ilmb_v10/LMB_Sl_0] [get_bd_intf_pins lmb_bram_if_cntlr/SLMB]
connect_bd_intf_net [get_bd_intf_pins lmb_bram/BRAM_PORTA] [get_bd_intf_pins lmb_bram_if_cntlr/BRAM_PORT]
connect_bd_intf_net [get_bd_intf_pins DLMB] [get_bd_intf_pins dlmb_v10/LMB_M]
connect_bd_net [get_bd_pins SYS_Rst] [get_bd_pins dlmb_v10/SYS_Rst] [get_bd_pins ilmb_v10/SYS_Rst] [get_bd_pins lmb_bram_if_cntlr/LMB_Rst]
connect_bd_net -net microblaze_0_Clk [get_bd_pins LMB_Clk] \
  [get_bd_pins dlmb_v10/LMB_Clk] [get_bd_pins ilmb_v10/LMB_Clk] [get_bd_pins lmb_bram_if_cntlr/LMB_Clk]
set_property HDL_ATTRIBUTE.BMM_INFO_ADDRESS_SPACE {byte  0x00000000 32 > base_with_comblock_desing iop_pmodb/lmb/lmb_bram} [get_bd_cells lmb_bram_if_cntlr]
set_property HDL_ATTRIBUTE.KEEP_HIERARCHY yes [get_bd_cells lmb_bram_if_cntlr]

current_bd_instance /trace_analyzer_arduino
connect_bd_intf_net [get_bd_intf_pins S_AXI] [get_bd_intf_pins trace_cntrl_64_0/s_axi_trace_cntrl]
connect_bd_intf_net [get_bd_intf_pins M_AXI] [get_bd_intf_pins axi_dma_0/M_AXI_S2MM]
connect_bd_intf_net [get_bd_intf_pins axis_data_fifo_0/S_AXIS] [get_bd_intf_pins trace_cntrl_64_0/capture_64]
connect_bd_intf_net [get_bd_intf_pins axi_dma_0/S_AXIS_S2MM] [get_bd_intf_pins axis_data_fifo_0/M_AXIS]
connect_bd_intf_net [get_bd_intf_pins S_AXI_LITE] [get_bd_intf_pins axi_dma_0/S_AXI_LITE]
connect_bd_net [get_bd_pins constant_tkeep_tstrb/dout] [get_bd_pins trace_cntrl_64_0/trace_64_TKEEP] [get_bd_pins trace_cntrl_64_0/trace_64_TSTRB]
connect_bd_net [get_bd_pins data] [get_bd_pins trace_cntrl_64_0/trace_64_TDATA]
connect_bd_net -net ps7_0_FCLK_CLK3 [get_bd_pins s_axi_aclk] \
  [get_bd_pins axi_dma_0/m_axi_s2mm_aclk] [get_bd_pins axi_dma_0/s_axi_lite_aclk] [get_bd_pins axis_data_fifo_0/s_axis_aclk] \
  [get_bd_pins trace_cntrl_64_0/ap_clk]
connect_bd_net -net rst_ps7_0_166M_peripheral_aresetn [get_bd_pins s_axi_aresetn] \
  [get_bd_pins axi_dma_0/axi_resetn] [get_bd_pins axis_data_fifo_0/s_axis_aresetn] [get_bd_pins trace_cntrl_64_0/ap_rst_n]
connect_bd_net -net trace_analyzer_arduino_s2mm_introut [get_bd_pins axi_dma_0/s2mm_introut] [get_bd_pins s2mm_introut]
connect_bd_net [get_bd_pins valid] [get_bd_pins trace_cntrl_64_0/trace_64_TVALID]

current_bd_instance /trace_analyzer_pmoda
connect_bd_intf_net [get_bd_intf_pins M_AXI] [get_bd_intf_pins axi_dma_0/M_AXI_S2MM]
connect_bd_intf_net [get_bd_intf_pins S_AXI] [get_bd_intf_pins trace_cntrl_32_0/s_axi_trace_cntrl]
connect_bd_intf_net [get_bd_intf_pins axi_dma_0/S_AXIS_S2MM] [get_bd_intf_pins axis_data_fifo_0/M_AXIS]
connect_bd_intf_net [get_bd_intf_pins S_AXI_LITE] [get_bd_intf_pins axi_dma_0/S_AXI_LITE]
connect_bd_intf_net [get_bd_intf_pins axis_data_fifo_0/S_AXIS] [get_bd_intf_pins trace_cntrl_32_0/capture_32]
connect_bd_net [get_bd_pins data] [get_bd_pins trace_cntrl_32_0/trace_32_TDATA]
connect_bd_net [get_bd_pins valid] [get_bd_pins trace_cntrl_32_0/trace_32_TVALID]
connect_bd_net [get_bd_pins constant_tkeep_tstrb/dout] [get_bd_pins trace_cntrl_32_0/trace_32_TKEEP] [get_bd_pins trace_cntrl_32_0/trace_32_TSTRB]
connect_bd_net -net ps7_0_FCLK_CLK3 [get_bd_pins s_axi_aclk] \
  [get_bd_pins axi_dma_0/m_axi_s2mm_aclk] [get_bd_pins axi_dma_0/s_axi_lite_aclk] [get_bd_pins axis_data_fifo_0/s_axis_aclk] \
  [get_bd_pins trace_cntrl_32_0/ap_clk]
connect_bd_net -net rst_ps7_0_166M_peripheral_aresetn [get_bd_pins s_axi_aresetn] \
  [get_bd_pins axi_dma_0/axi_resetn] [get_bd_pins axis_data_fifo_0/s_axis_aresetn] [get_bd_pins trace_cntrl_32_0/ap_rst_n]
connect_bd_net -net trace_analyzer_pmoda_s2mm_introut [get_bd_pins axi_dma_0/s2mm_introut] [get_bd_pins s2mm_introut]

current_bd_instance /video
connect_bd_intf_net [get_bd_intf_pins axi_vdma/M_AXIS_MM2S] [get_bd_intf_pins hdmi_out/in_stream]
connect_bd_intf_net [get_bd_intf_pins axi_mem_intercon/S01_AXI] [get_bd_intf_pins axi_vdma/M_AXI_MM2S]
connect_bd_intf_net [get_bd_intf_pins axi_mem_intercon/S00_AXI] [get_bd_intf_pins axi_vdma/M_AXI_S2MM]
connect_bd_intf_net [get_bd_intf_pins DDC] [get_bd_intf_pins hdmi_in/DDC]
connect_bd_intf_net [get_bd_intf_pins axi_vdma/S_AXIS_S2MM] [get_bd_intf_pins hdmi_in/out_stream]
connect_bd_intf_net [get_bd_intf_pins TMDS_out] [get_bd_intf_pins hdmi_out/TMDS_out]
connect_bd_intf_net [get_bd_intf_pins S_AXI] [get_bd_intf_pins axi_interconnect_0/S00_AXI]
connect_bd_intf_net [get_bd_intf_pins axi_interconnect_0/M01_AXI] [get_bd_intf_pins hdmi_out/S01_AXILite]
connect_bd_intf_net [get_bd_intf_pins axi_interconnect_0/M03_AXI] [get_bd_intf_pins hdmi_out/S04_AXILite]
connect_bd_intf_net [get_bd_intf_pins axi_interconnect_0/M02_AXI] [get_bd_intf_pins hdmi_out/S03_AXILite]
connect_bd_intf_net [get_bd_intf_pins axi_interconnect_0/M05_AXI] [get_bd_intf_pins hdmi_out/S00_AXILite]
connect_bd_intf_net [get_bd_intf_pins axi_interconnect_0/M07_AXI] [get_bd_intf_pins hdmi_in/S03_AXILite]
connect_bd_intf_net [get_bd_intf_pins axi_interconnect_0/M00_AXI] [get_bd_intf_pins axi_vdma/S_AXI_LITE]
connect_bd_intf_net [get_bd_intf_pins axi_interconnect_0/M04_AXI] [get_bd_intf_pins hdmi_out/S02_AXILite]
connect_bd_intf_net [get_bd_intf_pins axi_interconnect_0/M08_AXI] [get_bd_intf_pins hdmi_in/S00_AXILite]
connect_bd_intf_net [get_bd_intf_pins axi_interconnect_0/M06_AXI] [get_bd_intf_pins hdmi_in/S01_AXILite]
connect_bd_intf_net [get_bd_intf_pins TMDS_in] [get_bd_intf_pins hdmi_in/TMDS_in]
connect_bd_intf_net [get_bd_intf_pins axi_interconnect_0/M09_AXI] [get_bd_intf_pins hdmi_in/S02_AXILite]
connect_bd_intf_net [get_bd_intf_pins M_AXI] [get_bd_intf_pins axi_mem_intercon/M00_AXI]
connect_bd_net -net ARESETN_1 [get_bd_pins ic_resetn_clk100M] [get_bd_pins axi_interconnect_0/ARESETN]
connect_bd_net [get_bd_pins clk_100M] \
  [get_bd_pins axi_interconnect_0/ACLK] [get_bd_pins axi_interconnect_0/M00_ACLK] [get_bd_pins axi_interconnect_0/M03_ACLK] \
  [get_bd_pins axi_interconnect_0/M04_ACLK] [get_bd_pins axi_interconnect_0/M05_ACLK] \
  [get_bd_pins axi_interconnect_0/M08_ACLK] [get_bd_pins axi_interconnect_0/M09_ACLK] \
  [get_bd_pins axi_interconnect_0/S00_ACLK] [get_bd_pins axi_vdma/s_axi_lite_aclk] [get_bd_pins hdmi_in/clk_100M] \
  [get_bd_pins hdmi_out/clk_100M]
connect_bd_net [get_bd_pins periph_resetn_clk100M] \
  [get_bd_pins axi_interconnect_0/M00_ARESETN] [get_bd_pins axi_interconnect_0/M03_ARESETN] \
  [get_bd_pins axi_interconnect_0/M04_ARESETN] [get_bd_pins axi_interconnect_0/M05_ARESETN] \
  [get_bd_pins axi_interconnect_0/M08_ARESETN] [get_bd_pins axi_interconnect_0/M09_ARESETN] \
  [get_bd_pins axi_interconnect_0/S00_ARESETN] [get_bd_pins axi_vdma/axi_resetn] [get_bd_pins hdmi_in/periph_resetn_clk100M] \
  [get_bd_pins hdmi_out/periph_resetn_clk100M]
connect_bd_net -net RefClk_1 [get_bd_pins clk_200M] [get_bd_pins hdmi_in/clk_200M]
connect_bd_net -net aclk_1 [get_bd_pins clk_142M] \
  [get_bd_pins axi_interconnect_0/M01_ACLK] [get_bd_pins axi_interconnect_0/M02_ACLK] \
  [get_bd_pins axi_interconnect_0/M06_ACLK] [get_bd_pins axi_interconnect_0/M07_ACLK] [get_bd_pins axi_mem_intercon/ACLK] \
  [get_bd_pins axi_mem_intercon/M00_ACLK] [get_bd_pins axi_mem_intercon/S00_ACLK] [get_bd_pins axi_mem_intercon/S01_ACLK] \
  [get_bd_pins axi_vdma/m_axi_mm2s_aclk] [get_bd_pins axi_vdma/m_axi_s2mm_aclk] [get_bd_pins axi_vdma/m_axis_mm2s_aclk] \
  [get_bd_pins axi_vdma/s_axis_s2mm_aclk] [get_bd_pins hdmi_in/clk_142M] [get_bd_pins hdmi_out/clk_142M]
connect_bd_net -net axi_gpio_video_gpio_io_o [get_bd_pins hdmi_in/hdmi_in_hpd] [get_bd_pins hdmi_in_hpd]
connect_bd_net -net axi_gpio_video_ip2intc_irpt [get_bd_pins hdmi_in/hdmi_in_hpd_irq] [get_bd_pins xlconcat_0/In4]
connect_bd_net -net axi_vdma_0_mm2s_introut [get_bd_pins axi_vdma/mm2s_introut] [get_bd_pins xlconcat_0/In1]
connect_bd_net -net axi_vdma_0_s2mm_introut [get_bd_pins axi_vdma/s2mm_introut] [get_bd_pins xlconcat_0/In0]
connect_bd_net -net ext_reset_in_1 [get_bd_pins system_resetn] [get_bd_pins proc_sys_reset_pixelclk/ext_reset_in]
connect_bd_net [get_bd_pins hdmi_in/PixelClk] [get_bd_pins proc_sys_reset_pixelclk/slowest_sync_clk]
connect_bd_net [get_bd_pins hdmi_in/aPixelClkLckd] [get_bd_pins proc_sys_reset_pixelclk/aux_reset_in]
connect_bd_net -net hdmi_out_hpd_video_gpio_io_o [get_bd_pins hdmi_out/hdmi_out_hpd] [get_bd_pins hdmi_out_hpd]
connect_bd_net -net hdmi_out_hpd_video_ip2intc_irpt [get_bd_pins hdmi_out/hdmi_out_hpd_irq] [get_bd_pins xlconcat_0/In5]
connect_bd_net [get_bd_pins proc_sys_reset_pixelclk/peripheral_aresetn] [get_bd_pins hdmi_in/resetn]
connect_bd_net [get_bd_pins proc_sys_reset_pixelclk/peripheral_reset] [get_bd_pins hdmi_in/vid_io_in_reset]
connect_bd_net -net rst_ps7_0_100M_interconnect_aresetn [get_bd_pins ic_resetn_clk142M] [get_bd_pins axi_mem_intercon/ARESETN]
connect_bd_net -net rst_ps7_0_100M_peripheral_aresetn [get_bd_pins periph_resetn_clk142M] \
  [get_bd_pins axi_interconnect_0/M01_ARESETN] [get_bd_pins axi_interconnect_0/M02_ARESETN] \
  [get_bd_pins axi_interconnect_0/M06_ARESETN] [get_bd_pins axi_interconnect_0/M07_ARESETN] \
  [get_bd_pins axi_mem_intercon/M00_ARESETN] [get_bd_pins axi_mem_intercon/S00_ARESETN] \
  [get_bd_pins axi_mem_intercon/S01_ARESETN] [get_bd_pins hdmi_in/periph_resetn_clk142M] \
  [get_bd_pins hdmi_out/periph_resetn_clk142M]
connect_bd_net -net v_tc_0_irq [get_bd_pins hdmi_out/vtc_out_irq] [get_bd_pins xlconcat_0/In2]
connect_bd_net -net v_tc_1_irq [get_bd_pins hdmi_in/vtc_in_irq] [get_bd_pins xlconcat_0/In3]
connect_bd_net [get_bd_pins xlconcat_0/dout] [get_bd_pins video_irq]

current_bd_instance /video/hdmi_in
connect_bd_intf_net [get_bd_intf_pins S03_AXILite] [get_bd_intf_pins pixel_pack/s_axi_AXILiteS]
connect_bd_intf_net [get_bd_intf_pins S02_AXILite] [get_bd_intf_pins frontend/S02_AXILite]
connect_bd_intf_net [get_bd_intf_pins S01_AXILite] [get_bd_intf_pins color_convert/s_axi_AXILiteS]
connect_bd_intf_net [get_bd_intf_pins DDC] [get_bd_intf_pins frontend/DDC]
connect_bd_intf_net [get_bd_intf_pins out_stream] [get_bd_intf_pins pixel_pack/stream_out_32]
connect_bd_intf_net [get_bd_intf_pins TMDS_in] [get_bd_intf_pins frontend/TMDS_in]
connect_bd_intf_net [get_bd_intf_pins axis_register_slice_0/M_AXIS] [get_bd_intf_pins pixel_pack/stream_in_24]
connect_bd_intf_net [get_bd_intf_pins axis_register_slice_0/S_AXIS] [get_bd_intf_pins color_convert/stream_out_24]
connect_bd_intf_net [get_bd_intf_pins color_convert/stream_in_24] [get_bd_intf_pins frontend/video_out]
connect_bd_intf_net [get_bd_intf_pins S00_AXILite] [get_bd_intf_pins frontend/S00_AXILite]
connect_bd_net [get_bd_pins clk_100M] [get_bd_pins frontend/clk_100M]
connect_bd_net [get_bd_pins periph_resetn_clk100M] [get_bd_pins frontend/periph_resetn_clk100M]
connect_bd_net -net RefClk_1 [get_bd_pins clk_200M] [get_bd_pins frontend/clk_200M]
connect_bd_net -net aclk_1 [get_bd_pins clk_142M] \
  [get_bd_pins axis_register_slice_0/aclk] [get_bd_pins color_convert/ap_clk] [get_bd_pins color_convert/control] \
  [get_bd_pins frontend/clk_142M] [get_bd_pins pixel_pack/ap_clk] [get_bd_pins pixel_pack/control]
connect_bd_net -net axi_gpio_video_gpio_io_o [get_bd_pins frontend/hdmi_in_hpd] [get_bd_pins hdmi_in_hpd]
connect_bd_net -net axi_gpio_video_ip2intc_irpt [get_bd_pins frontend/hdmi_in_hpd_irq] [get_bd_pins hdmi_in_hpd_irq]
connect_bd_net -net dvi2rgb_0_PixelClk [get_bd_pins frontend/PixelClk] [get_bd_pins PixelClk]
connect_bd_net -net dvi2rgb_0_aPixelClkLckd [get_bd_pins frontend/aPixelClkLckd] [get_bd_pins aPixelClkLckd]
connect_bd_net [get_bd_pins resetn] [get_bd_pins frontend/resetn]
connect_bd_net -net rst_ps7_0_100M_peripheral_aresetn [get_bd_pins periph_resetn_clk142M] \
  [get_bd_pins axis_register_slice_0/aresetn] [get_bd_pins color_convert/ap_rst_n] \
  [get_bd_pins color_convert/ap_rst_n_control] [get_bd_pins pixel_pack/ap_rst_n] [get_bd_pins pixel_pack/ap_rst_n_control]
connect_bd_net -net v_tc_1_irq [get_bd_pins frontend/vtc_in_irq] [get_bd_pins vtc_in_irq]
connect_bd_net [get_bd_pins vid_io_in_reset] [get_bd_pins frontend/vid_io_in_reset]
